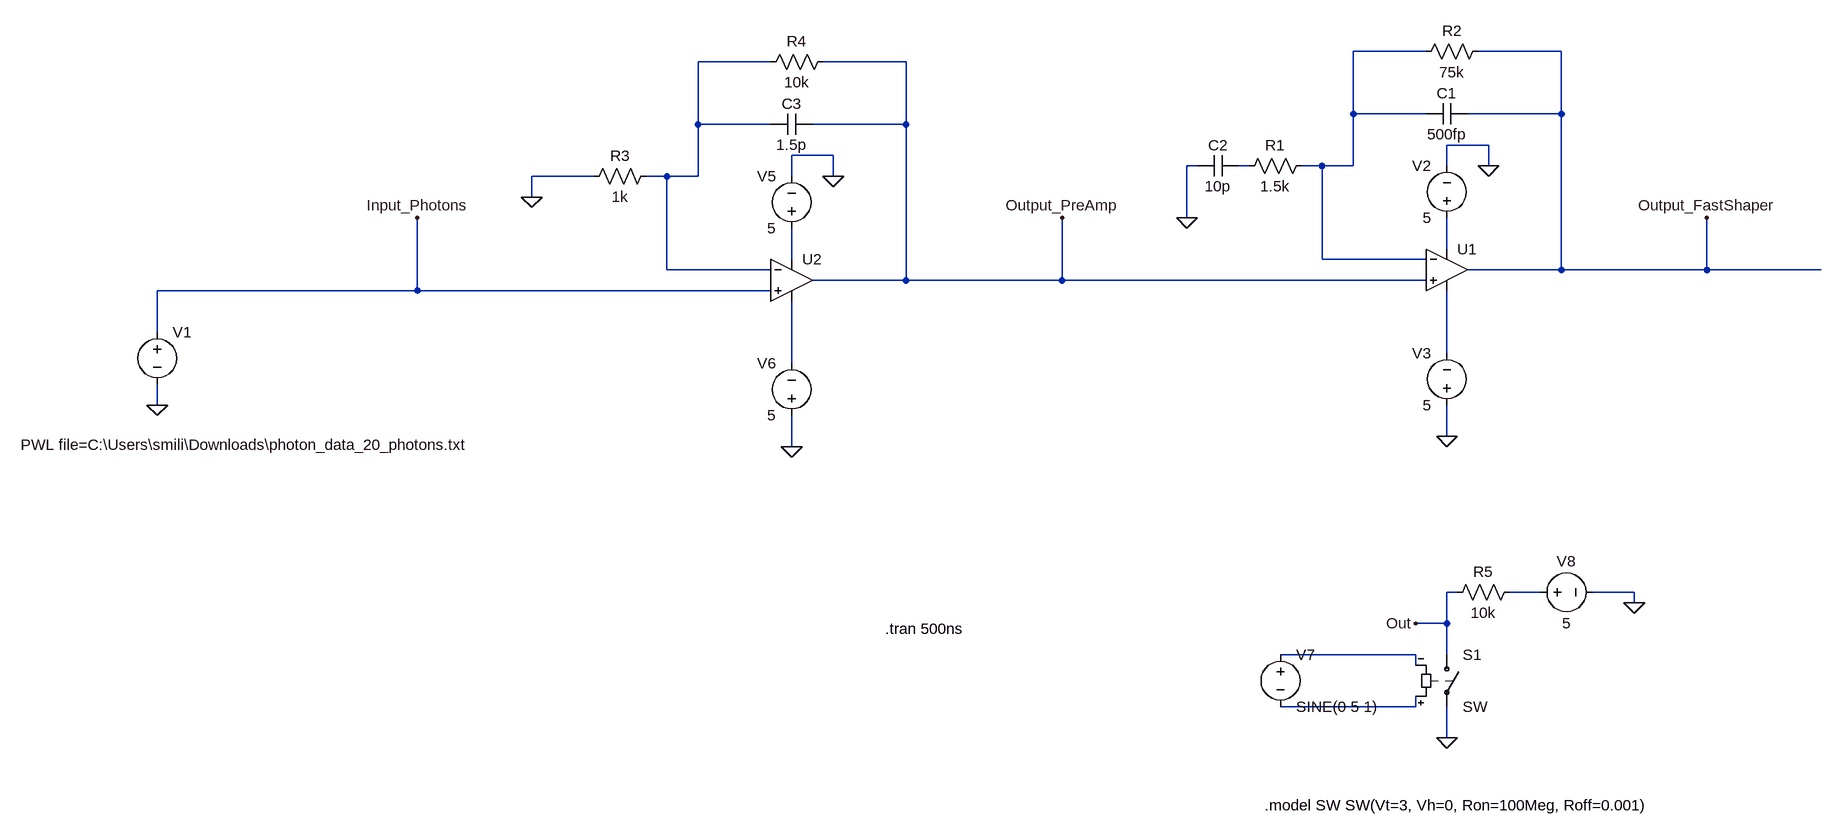
[diagram p0: schematic full_electronic_v2.asc]
full_electronic_v2.asc, the LTspice schematic file:
Version 4
SHEET 1 1976 680
WIRE -336 -960 -448 -960
WIRE -128 -960 -256 -960
WIRE -1344 -944 -1456 -944
WIRE -1136 -944 -1264 -944
WIRE -448 -864 -448 -960
WIRE -336 -864 -448 -864
WIRE -128 -864 -128 -960
WIRE -128 -864 -272 -864
WIRE -1456 -848 -1456 -944
WIRE -1344 -848 -1456 -848
WIRE -1136 -848 -1136 -944
WIRE -1136 -848 -1280 -848
WIRE -240 -816 -304 -816
WIRE -1248 -800 -1312 -800
WIRE -688 -784 -704 -784
WIRE -608 -784 -624 -784
WIRE -496 -784 -528 -784
WIRE -448 -784 -448 -864
WIRE -448 -784 -496 -784
WIRE -304 -784 -304 -816
WIRE -240 -784 -240 -816
WIRE -1616 -768 -1712 -768
WIRE -1504 -768 -1536 -768
WIRE -1456 -768 -1456 -848
WIRE -1456 -768 -1504 -768
WIRE -1312 -768 -1312 -800
WIRE -1248 -768 -1248 -800
WIRE -1712 -736 -1712 -768
WIRE -704 -704 -704 -784
WIRE -304 -656 -304 -704
WIRE -1312 -640 -1312 -688
WIRE -496 -640 -496 -784
WIRE -336 -640 -496 -640
WIRE -1504 -624 -1504 -768
WIRE -1344 -624 -1504 -624
WIRE -128 -624 -128 -864
WIRE -128 -624 -272 -624
WIRE 96 -624 96 -704
WIRE 96 -624 -128 -624
WIRE 272 -624 96 -624
WIRE -1136 -608 -1136 -848
WIRE -1136 -608 -1280 -608
WIRE -896 -608 -896 -704
WIRE -896 -608 -1136 -608
WIRE -336 -608 -896 -608
WIRE -1888 -592 -1888 -704
WIRE -1888 -592 -2288 -592
WIRE -1344 -592 -1888 -592
WIRE -2288 -528 -2288 -592
WIRE -304 -496 -304 -592
WIRE -1312 -480 -1312 -576
WIRE -2288 -416 -2288 -448
WIRE -304 -368 -304 -416
WIRE -1312 -352 -1312 -400
WIRE -288 -128 -304 -128
WIRE -160 -128 -208 -128
WIRE -16 -128 -80 -128
WIRE -16 -112 -16 -128
WIRE -304 -80 -304 -128
WIRE -304 -80 -352 -80
WIRE -352 -32 -560 -32
WIRE -304 -32 -304 -80
WIRE -352 -16 -352 -32
WIRE -352 48 -352 32
WIRE -352 48 -560 48
WIRE -304 96 -304 48
FLAG -304 -368 0
FLAG -240 -784 0
FLAG -1312 -352 0
FLAG -1248 -768 0
FLAG -304 96 0
FLAG -16 -112 0
FLAG -352 -80 Out
FLAG -2288 -416 0
FLAG -1712 -736 0
FLAG -1888 -704 Input_Photons
FLAG -704 -704 0
FLAG -896 -704 Output_PreAmp
FLAG 96 -704 Output_FastShaper
SYMBOL res -512 -800 R90
WINDOW 0 0 56 VBottom 2
WINDOW 3 32 56 VTop 2
SYMATTR InstName R1
SYMATTR Value 1.5k
SYMBOL res -240 -976 R90
WINDOW 0 0 56 VBottom 2
WINDOW 3 32 56 VTop 2
SYMATTR InstName R2
SYMATTR Value 75k
SYMBOL voltage -304 -688 R180
WINDOW 0 24 96 Left 2
WINDOW 3 24 16 Left 2
WINDOW 123 0 0 Left 0
WINDOW 39 0 0 Left 0
SYMATTR InstName V2
SYMATTR Value 5
SYMBOL voltage -304 -400 R180
WINDOW 0 24 96 Left 2
WINDOW 3 24 16 Left 2
WINDOW 123 0 0 Left 0
WINDOW 39 0 0 Left 0
SYMATTR InstName V3
SYMATTR Value 5
SYMBOL OpAmps\\UniversalOpAmp1 -304 -624 R0
SYMATTR InstName U1
SYMATTR Value2 Avol=1Meg GBW=100Meg Vos=0
SYMBOL cap -272 -880 R90
WINDOW 0 0 32 VBottom 2
WINDOW 3 32 32 VTop 2
SYMATTR InstName C1
SYMATTR Value 500fp
SYMBOL cap -624 -800 R90
WINDOW 0 0 32 VBottom 2
WINDOW 3 32 32 VTop 2
SYMATTR InstName C2
SYMATTR Value 10p
SYMBOL res -1520 -784 R90
WINDOW 0 0 56 VBottom 2
WINDOW 3 32 56 VTop 2
SYMATTR InstName R3
SYMATTR Value 1k
SYMBOL res -1248 -960 R90
WINDOW 0 0 56 VBottom 2
WINDOW 3 32 56 VTop 2
SYMATTR InstName R4
SYMATTR Value 10k
SYMBOL voltage -1312 -672 R180
WINDOW 0 24 96 Left 2
WINDOW 3 24 16 Left 2
WINDOW 123 0 0 Left 0
WINDOW 39 0 0 Left 0
SYMATTR InstName V5
SYMATTR Value 5
SYMBOL voltage -1312 -384 R180
WINDOW 0 24 96 Left 2
WINDOW 3 24 16 Left 2
WINDOW 123 0 0 Left 0
WINDOW 39 0 0 Left 0
SYMATTR InstName V6
SYMATTR Value 5
SYMBOL OpAmps\\UniversalOpAmp1 -1312 -608 R0
SYMATTR InstName U2
SYMATTR Value2 Avol=1Meg GBW=70Meg Vos=0
SYMBOL cap -1280 -864 R90
WINDOW 0 0 32 VBottom 2
WINDOW 3 32 32 VTop 2
SYMATTR InstName C3
SYMATTR Value 1.5p
SYMBOL sw -304 -48 R0
SYMATTR InstName S1
SYMBOL voltage -560 -48 R0
WINDOW 123 0 0 Left 0
WINDOW 39 0 0 Left 0
SYMATTR InstName V7
SYMATTR Value SINE(0 5 1)
SYMBOL voltage -176 -128 R270
WINDOW 0 32 56 VTop 2
WINDOW 3 -32 56 VBottom 2
SYMATTR InstName V8
SYMATTR Value 5
SYMBOL res -192 -144 R90
WINDOW 0 0 56 VBottom 2
WINDOW 3 32 56 VTop 2
SYMATTR InstName R5
SYMATTR Value 10k
SYMBOL voltage -2288 -544 R0
WINDOW 3 -210 189 Left 2
WINDOW 123 0 0 Left 0
WINDOW 39 0 0 Left 0
SYMATTR InstName V1
SYMATTR Value PWL file=C:\Users\smili\Downloads\photon_data_20_photons.txt
TEXT -584 200 Left 2 !.model SW SW(Vt=3, Vh=0, Ron=100Meg, Roff=0.001)
TEXT -1168 -72 Left 2 !.tran 500ns

The netlist it stands for:
* full_electronic_v2.asc
R1 N001 N003 1.5k
R2 Output_FastShaper N001 75k
V2 N004 0 5
V3 0 N006 5
XU1 Output_PreAmp N001 N004 N006 Output_FastShaper level1 Avol=1Meg GBW=100Meg Vos=0 En=0 Enk=0 In=0 Ink=0 Rin=500Meg  ; pins In+ In- V+ V- OUT
C1 Output_FastShaper N001 500fp
C2 N003 0 10p
R3 N002 0 1k
R4 Output_PreAmp N002 10k
V5 N005 0 5
V6 0 N007 5
XU2 Input_Photons N002 N005 N007 Output_PreAmp level1 Avol=1Meg GBW=70Meg Vos=0 En=0 Enk=0 In=0 Ink=0 Rin=500Meg  ; pins In+ In- V+ V- OUT
C3 Output_PreAmp N002 1.5p
S1 Out 0 N010 N009 SW
V7 N009 N010 SINE(0 5 1)
V8 N008 0 5
R5 N008 Out 10k
V1 Input_Photons 0 PWL file=C:\Users\smili\Downloads\photon_data_20_photons.txt
.model SW SW(Vt=3, Vh=0, Ron=100Meg, Roff=0.001)
.tran 500ns
.lib UniversalOpAmp1.lib
.backanno
.end